# EAGLE design RelAC (EAGLE 9.6.2)
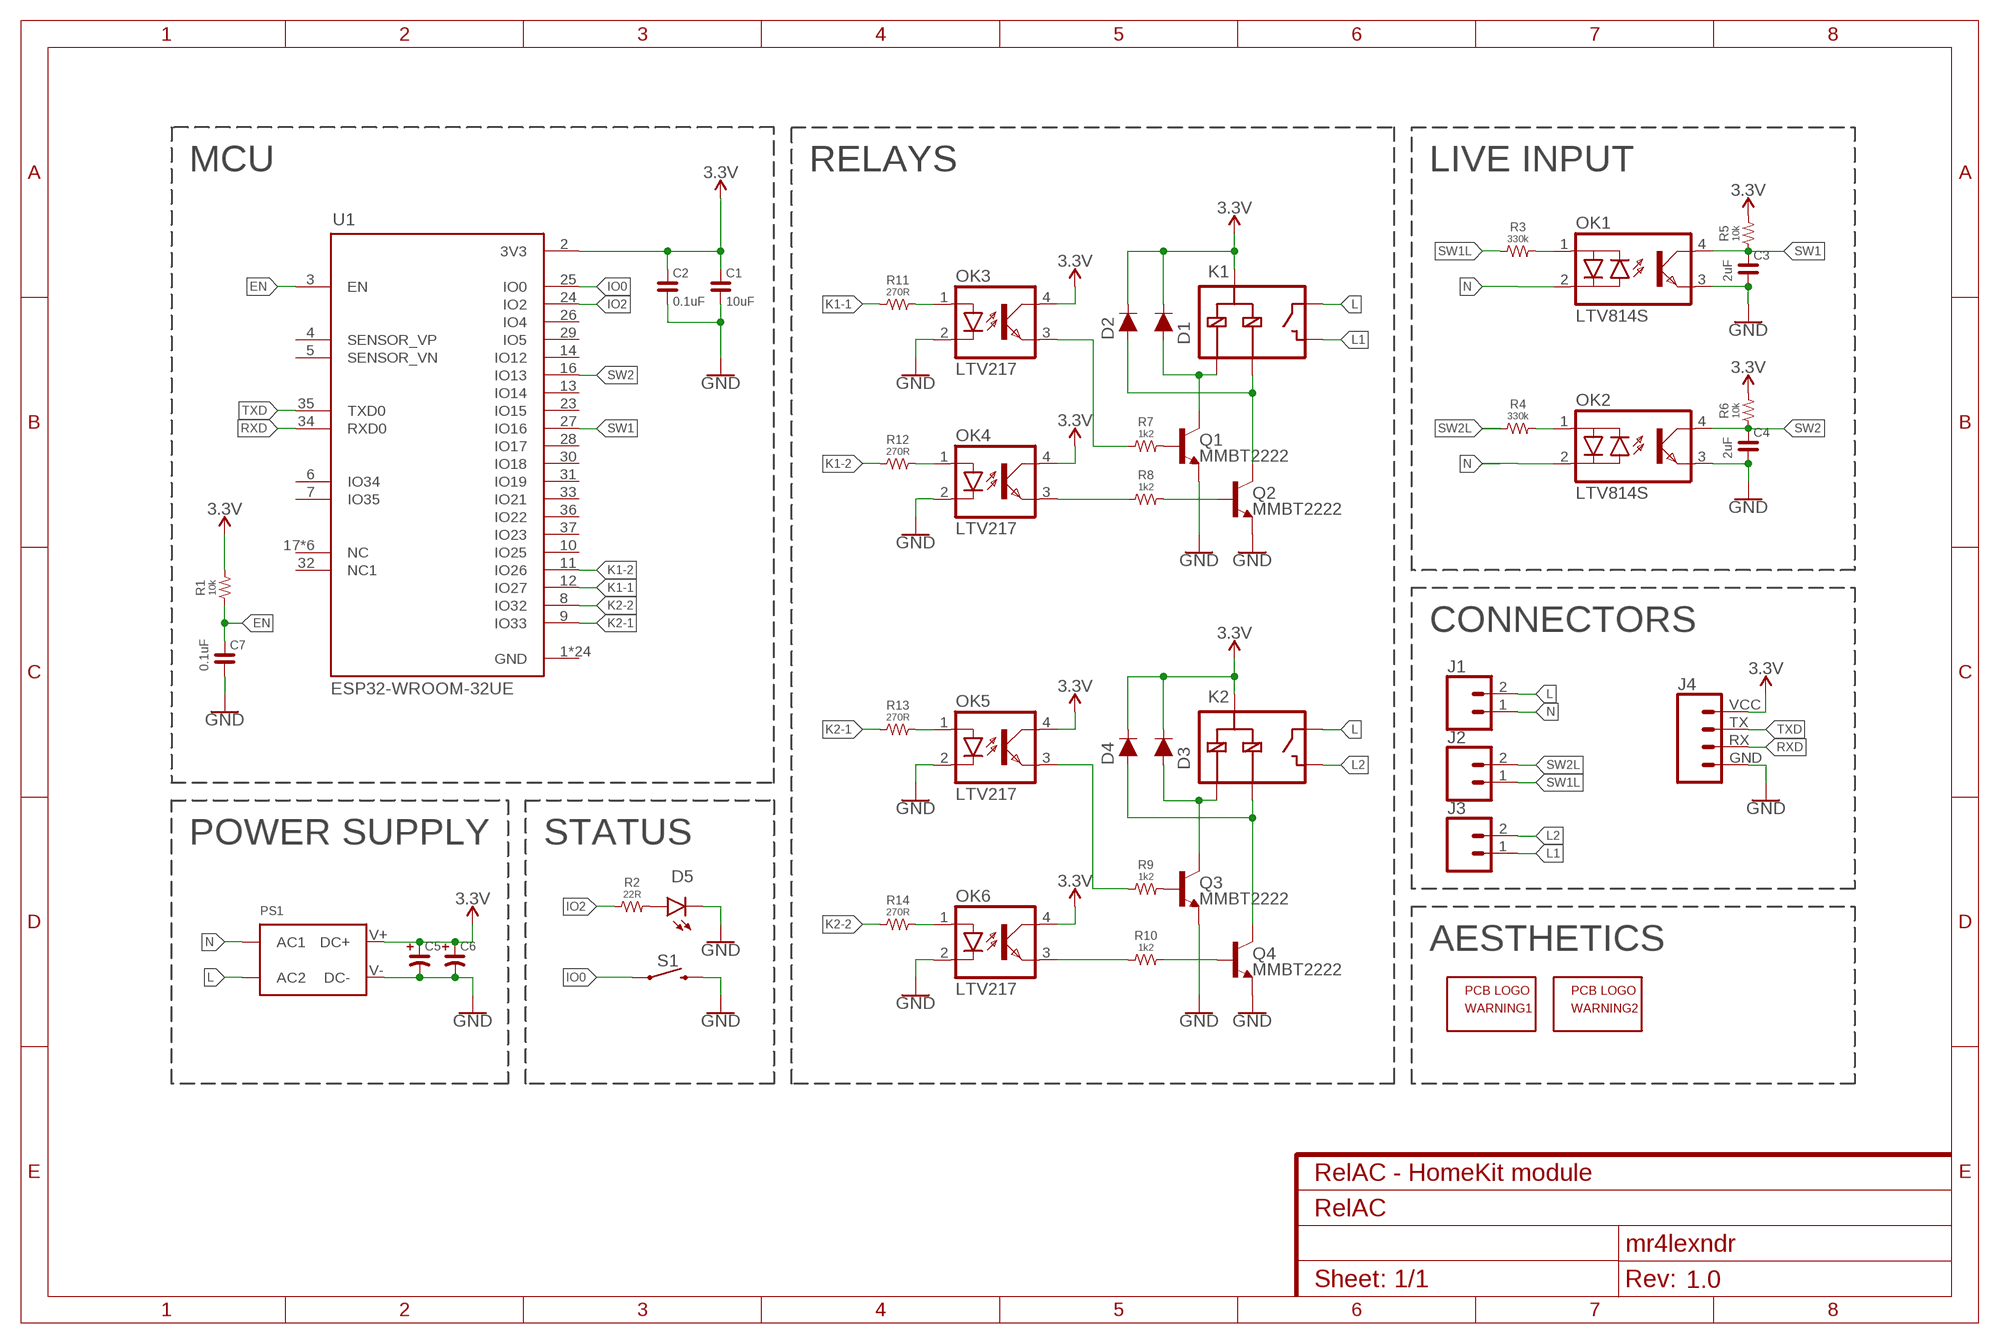
[diagram p0: schematic, sheet 1]
FRAME1 (FRAME-A4L): CNAME: RelAC - HomeKit module; CREVISION: 1.0; DESIGNER: mr4lexndr

## Parts
C1  10uF  CAP-0805  [0805]
C2  0.1uF  CAP-0603  [0603]
C3  2uF  CAP-0805  [0805]
C4  2uF  CAP-0805  [0805]
C5  CAP-POLAR-THT_2.5MM-W  [CPOL-RADIAL-2.5MM-6.5MM]
C6  CAP-POLAR-THT_2.5MM-W  [CPOL-RADIAL-2.5MM-6.5MM]
C7  0.1uF  CAP-0603  [0603]
D1  DIODE-SOD323  [SOD-323]
D2  DIODE-SOD323  [SOD-323]
D3  DIODE-SOD323  [SOD-323]
D4  DIODE-SOD323  [SOD-323]
D5  LED-ANGLE-2MM  [LED-ANGLE-2MM]
J1  CONN_02-5MM-SCREWTERMINAL  [SCREWTERMINAL-5MM-2-DIBO]
J2  CONN_02-5MM-SCREWTERMINAL  [SCREWTERMINAL-5MM-2-DIBO]
J3  CONN_02-5MM-SCREWTERMINAL  [SCREWTERMINAL-5MM-2-DIBO]
J4  CONN_04-UART-SMD  [UART]
K1  RELAY-SPST-LATCHING  [RELAY-PANASONIC-ADW1203HLW]
K2  RELAY-SPST-LATCHING  [RELAY-PANASONIC-ADW1203HLW]
OK1  LTV814S  OPTOCOUPLER-AC-LTV814S  [DIL4-SMD-SMALL]
OK2  LTV814S  OPTOCOUPLER-AC-LTV814S  [DIL4-SMD-SMALL]
OK3  LTV217  OPTOCOUPLER-LTV217  [MINI-FLAT-4]
OK4  LTV217  OPTOCOUPLER-LTV217  [MINI-FLAT-4]
OK5  LTV217  OPTOCOUPLER-LTV217  [MINI-FLAT-4]
OK6  LTV217  OPTOCOUPLER-LTV217  [MINI-FLAT-4]
PS1  POWER-SUPPLY-HI-LINK-5W  [HI-LINK-POWER-SUPPLY]
Q1  MMBT2222  TRANS_NPN-MMBT2222AL  [SOT23-3]
Q2  MMBT2222  TRANS_NPN-MMBT2222AL  [SOT23-3]
Q3  MMBT2222  TRANS_NPN-MMBT2222AL  [SOT23-3]
Q4  MMBT2222  TRANS_NPN-MMBT2222AL  [SOT23-3]
R1  10k  RESISTOR0603  [0603]
R2  22R  RESISTOR0603  [0603]
R3  330k  RESISTOR0805  [0805]
R4  330k  RESISTOR0805  [0805]
R5  10k  RESISTOR0603  [0603]
R6  10k  RESISTOR0603  [0603]
R7  1k2  RESISTOR0603  [0603]
R8  1k2  RESISTOR0603  [0603]
R9  1k2  RESISTOR0603  [0603]
R10  1k2  RESISTOR0603  [0603]
R11  270R  RESISTOR0603  [0603]
R12  270R  RESISTOR0603  [0603]
R13  270R  RESISTOR0603  [0603]
R14  270R  RESISTOR0603  [0603]
S1  MOMENTARY-SWITCH-SPST-PTH-RIGHT-ANGLE-KIT  [TACTILE_SWITCH_PTH_RIGHT_ANGLE_KIT]
U1  ESP32-WROOM-32UE  ESP32-WROOM-32UE(M113EH6400UH3Q0)  [MODULE_ESP32-WROOM-32UE(M113EH6400UH3Q0)]
WARNING1  PCB-GRAPHICS-HIGH-VOLTAGE  [HIGH-VOLTAGE]
WARNING2  PCB-GRAPHICS-HIGH-VOLTAGE  [HIGH-VOLTAGE]

## Nets
3.3V: C1.2 C2.2 C5.+ C6.+ D1.C D2.C D3.C D4.C J4.VCC K1.COILM(COIL-COM) K2.COILM(COIL-COM) OK3.4(COL) OK4.4(COL) OK5.4(COL) OK6.4(COL) PS1.V+(DC+) R1.2 R5.2 R6.2 U1.2(3V3)
EN: C7.2 R1.1 U1.3(EN)
GND: C1.1 C2.1 C3.1 C4.1 C5.- C6.- C7.1 D5.C J4.GND OK1.3(EMIT) OK2.3(EMIT) OK3.2(C) OK4.2(C) OK5.2(C) OK6.2(C) PS1.V-(DC-) Q1.2(E) Q2.2(E) Q3.2(E) Q4.2(E) S1.2
IO0: S1.1 U1.25(IO0)
IO2: R2.1 U1.24(IO2)
K1-1: R11.1 U1.12(IO27)
K1-2: R12.1 U1.11(IO26)
K2-1: R13.1 U1.9(IO33)
K2-2: R14.1 U1.8(IO32)
L: J1.2 K1.POLE K2.POLE PS1.AC2
L1: J3.1 K1.NO
L2: J3.2 K2.NO
N: J1.1 OK1.2(C) OK2.2(C) PS1.AC1
N$2: D2.A K1.COIL2 Q2.3(C)
N$3: D1.A K1.COIL1 Q1.3(C)
N$4: OK1.1(A) R3.2
N$6: D5.A R2.2
N$7: OK2.1(A) R4.2
N$9: Q1.1(B) R7.2
N$10: Q2.1(B) R8.2
N$11: OK3.3(EMIT) R7.1
N$12: OK4.3(EMIT) R8.1
N$13: D3.A K2.COIL1 Q3.3(C)
N$14: D4.A K2.COIL2 Q4.3(C)
N$15: Q3.1(B) R9.2
N$16: Q4.1(B) R10.2
N$17: OK6.3(EMIT) R10.1
N$18: OK5.3(EMIT) R9.1
N$25: OK6.1(A) R14.2
N$26: OK5.1(A) R13.2
N$27: OK4.1(A) R12.2
N$28: OK3.1(A) R11.2
RXD: J4.RX U1.34(RXD0)
SW1: C3.2 OK1.4(COL) R5.1 U1.27(IO16)
SW1L: J2.1 R3.1
SW2: C4.2 OK2.4(COL) R6.1 U1.16(IO13)
SW2L: J2.2 R4.1
TXD: J4.TX U1.35(TXD0)
Unconnected: U1.4(SENSOR_VP) U1.5(SENSOR_VN) U1.6(IO34) U1.7(IO35) U1.10(IO25) U1.13(IO14) U1.14(IO12) U1.17(NC) U1.18(NC) U1.19(NC) U1.20(NC) U1.21(NC) U1.22(NC) U1.23(IO15) U1.26(IO4) U1.28(IO17) U1.29(IO5) U1.30(IO18) U1.31(IO19) U1.32(NC1) U1.33(IO21) U1.36(IO22) U1.37(IO23)

## Notes on the sheet
- MCU | RELAYS | LIVE INPUT
- CONNECTORS
- POWER SUPPLY | STATUS
- AESTHETICS

## Power pins joined to a net without a drawn wire
GND: U1.1(GND) U1.15(GND) U1.38(GND) U1.39_1(GND) U1.39_2(GND) U1.39_3(GND) U1.39_4(GND) U1.39_5(GND) U1.39_6(GND) U1.39_7(GND) U1.39_8(GND) U1.39_9(GND) U1.39_10(GND) U1.39_11(GND) U1.39_12(GND) U1.39_13(GND) U1.39_14(GND) U1.39_15(GND) U1.39_16(GND) U1.39_17(GND) U1.39_18(GND) U1.39_19(GND) U1.39_20(GND) U1.39_21(GND)

## Library data of the parts
C1-C4 C7 = #AK-Library:CAP
C5 C6 = #AK-Library:CAP-POLAR: POLARIZED CAP
D1-D4 = #AK-Library:DIODE
D5 = #AK-Library:LED: LED (Generic) Standard schematic elements and footprints for 5mm, 3mm, 1206, and 0603 sized LEDs. Generic LEDs with no color specified.
J1-J3 = #Connectors:CONN_02: Multi connection point. Often used as Generic Header-pin footprint for 0.1 inch spaced/style header connections On any of the 0.1 inch spaced packages, you can populate with these: Break Away Headers - Straight <https://www.sparkfun.com/products/116> (PRT-00116) Break Away Male Headers - Right Angle <https://www.sparkfun.com/products/553> (PRT-00553) Female Headers <https://www.sparkfun.com/products/115> (PRT-00115) Break Away Headers - Machine Pin <https://www.sparkfun.com/products/117> (PRT-00117) Break Away Female Headers - Swiss Machine Pin <https://www.sparkfun.com/products/743> (PRT-00743) For SCREWTERMINALS and SPRING TERMINALS visit here: Screw Terimnals on SparkFun.com <https://www.sparkfun.com/search/results?term=Screw+Terminals> (5mm/3.5mm/2.54mm spacing) This device is also useful as a general connection point to wire up your design to another part of your project. Our various solder wires solder well into these plated through hole pads. Hook-Up Wire - Assortment (Stranded, 22 AWG) <https://www.sparkfun.com/products/11375> (PRT-11375) Hook-Up Wire - Assortment (Solid Core, 22 AWG) <https://www.sparkfun.com/products/11367> (PRT-11367) View the entire wire category on our website here <https://www.sparkfun.com/categories/141> Special notes: Molex polarized connector foot print use with: PRT-08233 with associated crimp pins and housings. 2.54_SCREWTERM for use with PRT-10571. 3.5mm Screw Terminal footprints for PRT-08084 5mm Screw Terminal footprints for use with PRT-08432
J4 = #Connectors:CONN_04: Multi connection point. Often used as Generic Header-pin footprint for 0.1 inch spaced/style header connections On any of the 0.1 inch spaced packages, you can populate with these: Break Away Headers - Straight <https://www.sparkfun.com/products/116> (PRT-00116) Break Away Male Headers - Right Angle <https://www.sparkfun.com/products/553> (PRT-00553) Female Headers <https://www.sparkfun.com/products/115> (PRT-00115) Break Away Headers - Machine Pin <https://www.sparkfun.com/products/117> (PRT-00117) Break Away Female Headers - Swiss Machine Pin <https://www.sparkfun.com/products/743> (PRT-00743) For SCREWTERMINALS and SPRING TERMINALS visit here: Screw Terimnals on SparkFun.com <https://www.sparkfun.com/search/results?term=Screw+Terminals> (5mm/3.5mm/2.54mm spacing) This device is also useful as a general connection point to wire up your design to another part of your project. Our various solder wires solder well into these plated through hole pads. Hook-Up Wire - Assortment (Stranded, 22 AWG) <https://www.sparkfun.com/products/11375> (PRT-11375) Hook-Up Wire - Assortment (Solid Core, 22 AWG) <https://www.sparkfun.com/products/11367> (PRT-11367) View the entire wire category on our website here <https://www.sparkfun.com/categories/141> Special notes: Molex polarized connector foot print use with SKU : PRT-08231 with associated crimp pins and housings. 1MM SMD Version SKU: PRT-10208
K1 K2 = #AK-Library:RELAY-SPST-LATCHING
OK1 OK2 = #AK-Library:OPTOCOUPLER-AC
OK3-OK6 = #AK-Library:OPTOCOUPLER: OPTO COUPLER Source: LITEON, LTV816.pdf
PS1 = #AK-Library:POWER-SUPPLY
Q1-Q4 = #AK-Library:TRANS_NPN: NPN transistor Current controlled devices typically used to amplify current or used as a switch. BC547 - COM-08928 <http://www.sparkfun.com/products/8928> (TO-92 45V 100mA) (1.Collector 2.Base 3.Emitter) 2N3904 - COM-00521 <http://www.sparkfun.com/products/521> (TO-92 40V 200mA) (1.Emitter 2.Base 3.Collector) P2N2222A - COM-12852 <http://www.sparkfun.com/products/12852> (TO-92 40V 600mA) (1.Collector 2.Base 3.Emitter); PROD_ID: TRANS-08049; VALUE: 600mA/40V
R1-R14 = #AK-Library:RESISTOR: Generic Resistor Package
S1 = #AK-Library:MOMENTARY-SWITCH-SPST: Momentary Switch (Pushbutton) - SPST Normally-open (NO) SPST momentary switches (buttons, pushbuttons). Variants PTH-12MM - 12mm square, through-hole Momentary Pushbutton Switch - 12mm Square <https://www.sparkfun.com/products/9190> (COM-09190) PTH-6.0MM, PTH-6.0MM-KIT - 6.0mm square, through-hole Mini Pushbutton Switch <https://www.sparkfun.com/products/97> (COM-00097) KIT package intended for soldering kit's - only one side of pads' copper is exposed. PTH-RIGHT-ANGLE-KIT - Right-angle, through-hole Right Angle Tactile Button <https://www.sparkfun.com/products/10791> - Used on SparkFun BigTime Watch Kit <https://www.sparkfun.com/products/11734> SMD-12MM - 12mm square, surface-mount Tactile Button - SMD (12mm) <https://www.sparkfun.com/products/12993> (COM-12993) Used on SparkFun PicoBoard <https://www.sparkfun.com/products/11888> SMD-4.5MM - 4.5mm Square Trackball Switch Used on SparkFun Blackberry Trackballer Breakout <https://www.sparkfun.com/products/13169> SMD-4.6MMX2.8MM - 4.60mm x 2.80mm, surface mount Used on SparkFun SAMD21 Mini Breakout <https://www.sparkfun.com/products/13664> SMD-5.2MM, SMD-5.2-REDUNDANT - 5.2mm square, surface-mount Mini Pushbutton Switch - SMD <https://www.sparkfun.com/products/8720> (COM-08720) Used on Arduino Pro Mini <https://www.sparkfun.com/products/11114> REDUNDANT package connects both switch circuits together SMD-6.0X3.5MM - 6.0 x 3.5mm, surface mount Momentary Reset Switch SMD <https://www.sparkfun.com/products/8229> (COM-08229) SMD-6.2MM-TALL - 6.2mm square, surface mount Tactile Button - SMD (6mm) <https://www.sparkfun.com/products/12992> Used on SparkFun Digital Sandbox <https://www.sparkfun.com/products/12651> SMD-RIGHT-ANGLE - Right-angle, surface mount Used on SparkFun Block for Intel® Edison - Arduino <https://www.sparkfun.com/products/13036>; PROD_ID: CONN-10672; SF_SKU: COM-10791
U1 = #AK-Library:ESP32-WROOM-32UE(M113EH6400UH3Q0): WiFi Modules (802.11) SMD module ESP32-D0WD-V3, ESP32 ECO V3, 8 MB SPI flash, IPEX antenna connector Check availability <https://pricing.snapeda.com/parts/ESP32-WROOM-32UE%28M113EH6400UH3Q0%29/Espressif%20Systems/view-part?ref=eda>; AVAILABILITY: Not in stock; DESCRIPTION: Bluetooth, WiFi 802.11b/g/n, Bluetooth v4.2 +EDR, Class 1, 2 and 3 Transceiver Module 2.4GHz ~ 2.5GHz Antenna Not Included, U.FL Surface Mount; MF: Espressif Systems; MP: ESP32-WROOM-32UE(M113EH6400UH3Q0); PACKAGE: None; PRICE: None
WARNING1 WARNING2 = #AK-Library:PCB-GRAPHICS

## Board
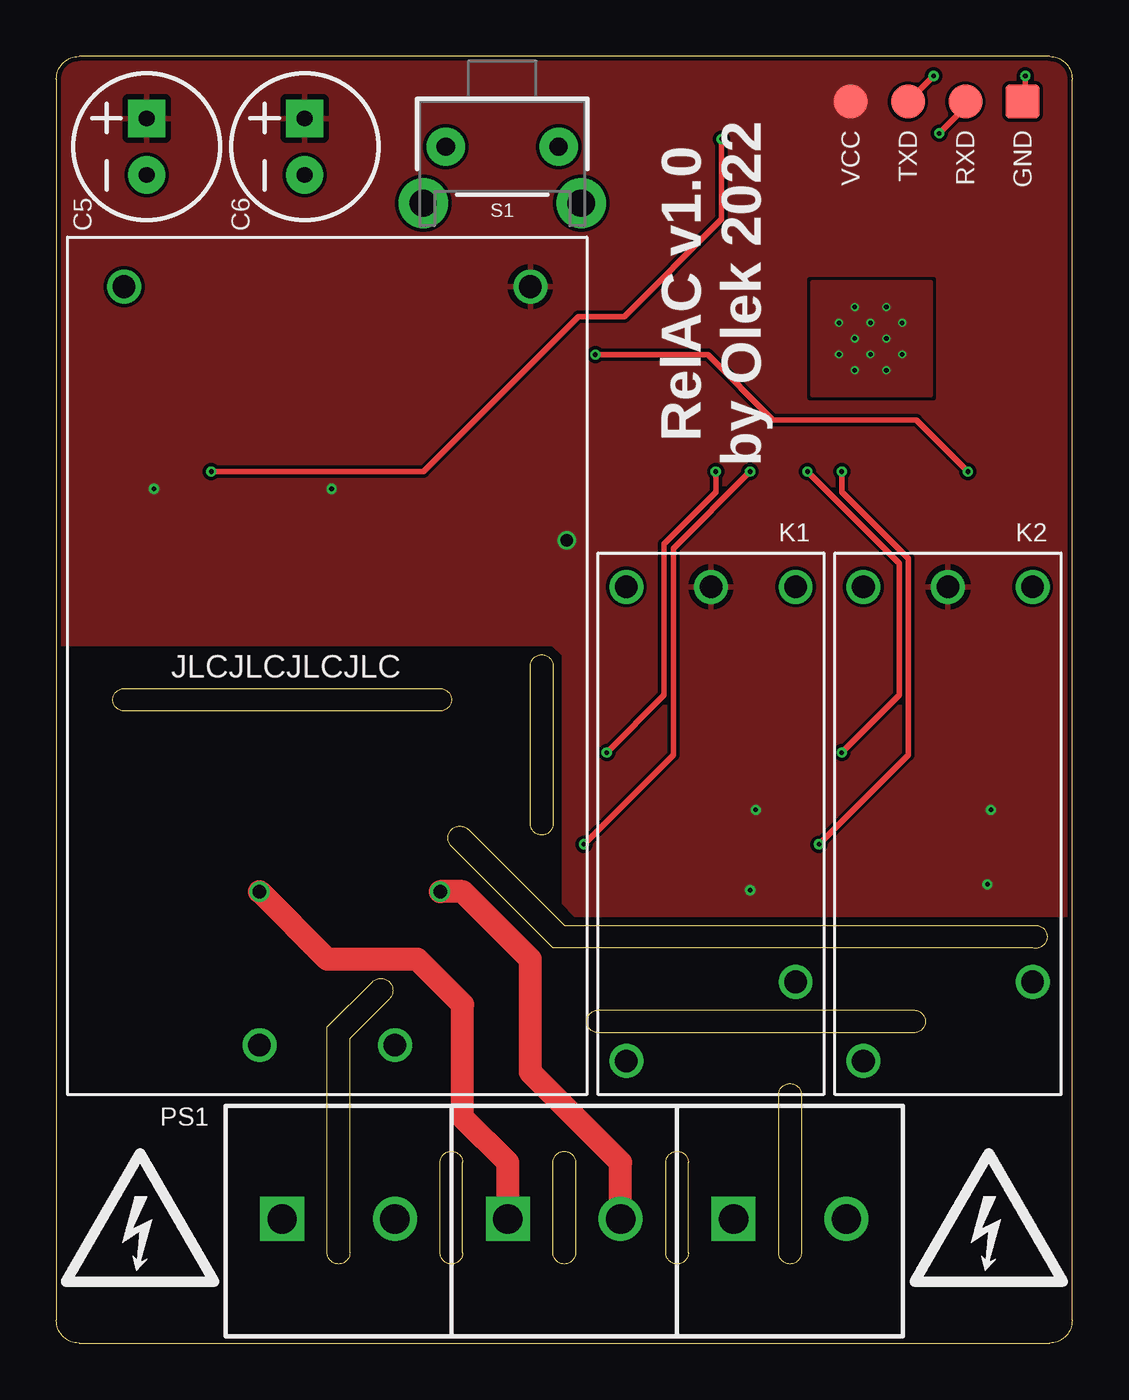
[diagram p1: board, top side]
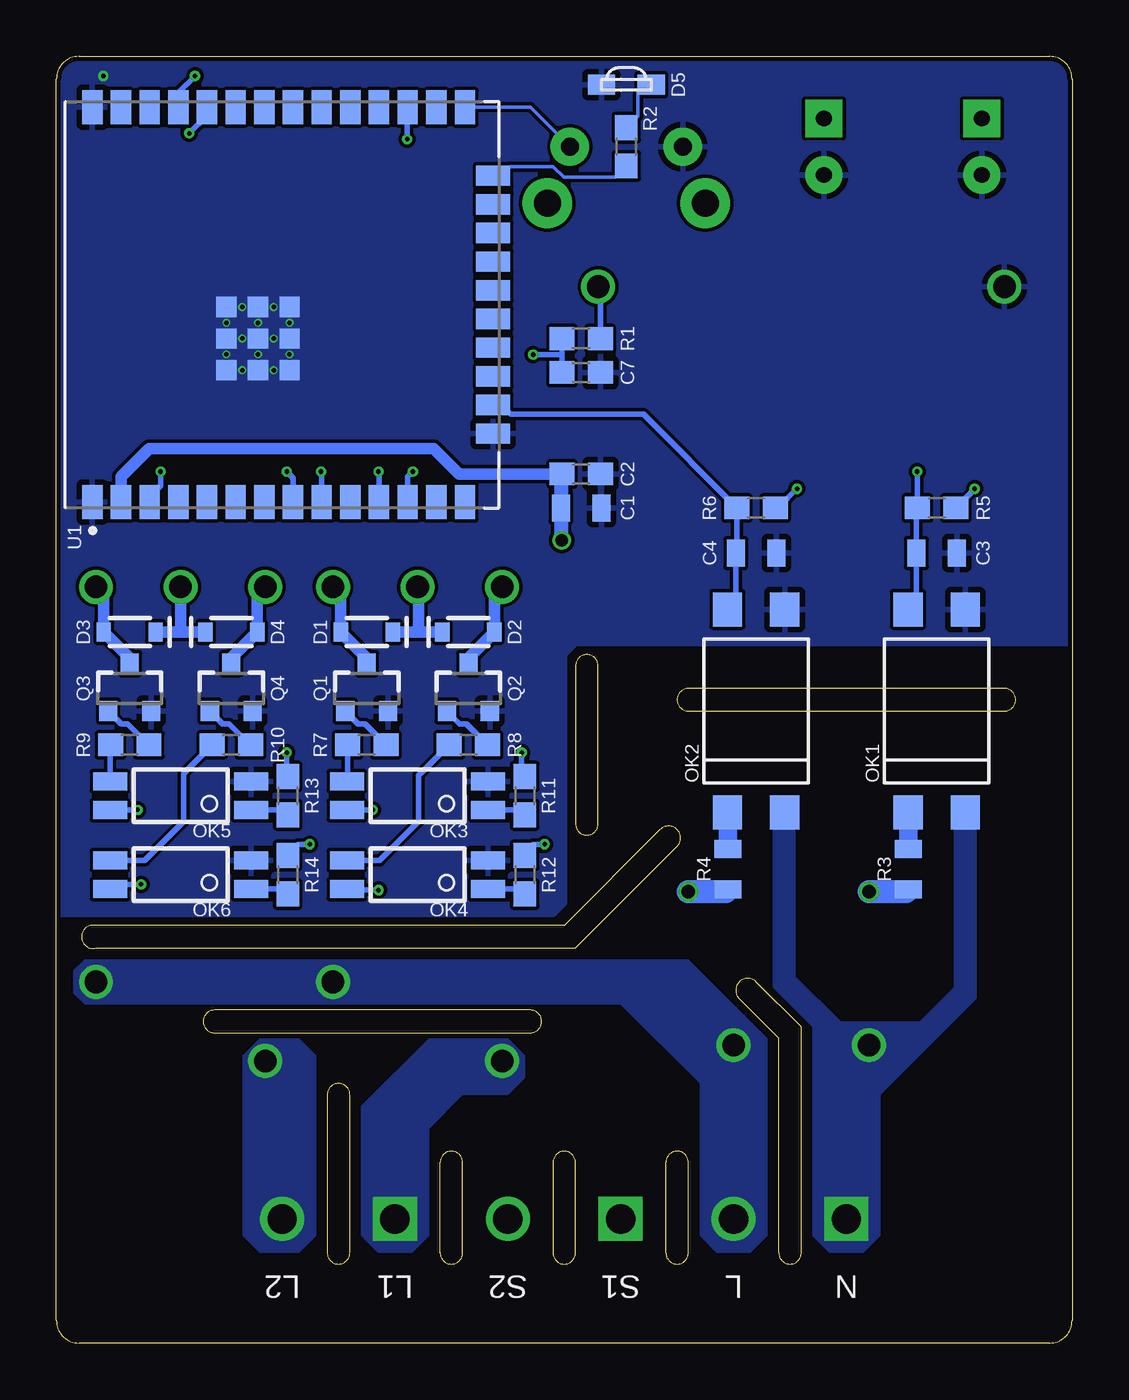
[diagram p2: board, bottom side, seen from below]

Size 45 x 57 mm. Coordinates in mm from the lower left corner, seen from the top.
Outline: 1,0 44,0 arc90 45,1 45,56 arc90 44,57 1,57 arc90 0,56 0,1 arc90 1,0
Outline: 43.25,17.5 22,17.5 17.5,22 arc-180 18.25,22.75 22.5,18.5 43.5,18.5 arc-180 43.25,17.5
Outline: 3,29 17,29 arc-180 17,28 3,28 arc-180 3,29
Outline: 22,30 22,23 arc-180 21,23 21,30 arc-180 22,30
Outline: 13,4 13,13.5 14.75,15.25 arc180 14,16 12,14 12,4 arc180 13,4
Outline: 18,4 18,8 arc180 17,8 17,4 arc180 18,4
Outline: 22,4 22,8 arc-180 23,8 23,4 arc-180 22,4
Outline: 27,4 27,8 arc-180 28,8 28,4 arc-180 27,4
Outline: 32,4 32,11 arc-180 33,11 33,4 arc-180 32,4
Outline: 38,13.75 24,13.75 arc-180 24,14.75 38,14.75 arc-180 38,13.75
Copper layers (1*16): Top 0.035mm / dielectric 1.5mm / Bottom 0.035mm
Design rules "JLCPCB": minimum track width 6mil, minimum drill 0.2mm, track to track 6mil, track to pad 6mil, pad to pad 6mil, via to via 6mil, smd to smd 6mil, copper to edge 0.2mm, drill to drill 0.1mm, minimum pad ring 3mil, minimum via ring 0.125mm, stop-mask expansion 4mil, vias tented up to drill 0.75mm, thermal gap 10mil

### Footprints (pad centres in the part's own frame; a part is rotated, then mirrored left to right if it is on the bottom)
0805 = smd 0.8 x 1.2: 1 -0.9,0; 2 0.9,0
0603 = smd 1.1 x 1: 1 -0.85,0; 2 0.85,0
CPOL-RADIAL-2.5MM-6.5MM = drill 0.7 pad 1.651 square: + 1.25,0 | drill 0.7 pad 1.651: - -1.25,0
SOD-323 = smd 0.63 x 0.83: A 1.15,0; C -1.15,0
LED-ANGLE-2MM = smd 0.9 x 1.2: A 0,1.1; C 0,-1.1
SCREWTERMINAL-5MM-2-DIBO = drill 1.3 square: 1 0,0 | drill 1.3: 2 5,0
UART = smd 1.5 x 1.5: GND -3.81,0; RX -1.27,0; TX 1.27,0; VCC 3.81,0
RELAY-PANASONIC-ADW1203HLW = drill 1: COIL1 -10.5,3.75; COIL2 -10.5,-3.75; COILM -10.5,0; NO 10.5,-3.75; POLE 7,3.75
DIL4-SMD-SMALL = smd 1.3 x 1.5: 1 -1.27,-4.5; 2 1.27,-4.5; 3 1.27,4.5; 4 -1.27,4.5
MINI-FLAT-4 = smd 1.5 x 0.8: 1 -3.125,0.635; 2 -3.125,-0.635; 3 3.125,-0.635; 4 3.125,0.635
HI-LINK-POWER-SUPPLY = drill 1: AC1 -16.8,3; AC2 -16.8,-3; V+ 16.8,-9; V- 16.8,9
SOT23-3 = smd 0.8 x 0.9: 1 -0.95,-1; 2 0.95,-1; 3 0,1.1
TACTILE_SWITCH_PTH_RIGHT_ANGLE_KIT = drill 0.8 pad 1.7: 1 -2.5,0; 2 2.5,0 | drill 1.2 pad 2.2: ANCHOR1 -3.5,2.5; ANCHOR2 3.5,2.5
MODULE_ESP32-WROOM-32UE(M113EH6400UH3Q0) = smd 1.5 x 0.9: 1 -8.75,8.41; 2 -8.75,7.14; 3 -8.75,5.87; 4 -8.75,4.6; 5 -8.75,3.33; 6 -8.75,2.06; 7 -8.75,0.79; 8 -8.75,-0.48; 9 -8.75,-1.75; 10 -8.75,-3.02; 11 -8.75,-4.29; 12 -8.75,-5.56; 13 -8.75,-6.83; 14 -8.75,-8.1; 25 8.75,-8.1; 26 8.75,-6.83; 27 8.75,-5.56; 28 8.75,-4.29; 29 8.75,-3.02; 30 8.75,-1.75; 31 8.75,-0.48; 32 8.75,0.79; 33 8.75,2.06; 34 8.75,3.33; 35 8.75,4.6; 36 8.75,5.87; 37 8.75,7.14; 38 8.75,8.41 | smd 0.9 x 1.5: 15 -5.71,-9.35; 16 -4.44,-9.35; 17 -3.17,-9.35; 18 -1.9,-9.35; 19 -0.63,-9.35; 20 0.64,-9.35; 21 1.91,-9.35; 22 3.18,-9.35; 23 4.45,-9.35; 24 5.72,-9.35 | smd 0.9 x 0.9: 39_1 -2.9,2.47; 39_2 -1.5,2.47; 39_3 -0.1,2.47; 39_4 -2.9,1.07; 39_5 -1.5,1.07; 39_6 -0.1,1.07; 39_7 -2.9,-0.33; 39_8 -1.5,-0.33; 39_9 -0.1,-0.33 | drill 0.2 pad 0.3: 39_10 -2.2,2.47; 39_11 -0.8,2.47; 39_12 -2.9,1.77; 39_13 -1.5,1.77; 39_14 -0.1,1.77; 39_15 -2.2,1.07; 39_16 -0.8,1.07; 39_17 -2.9,0.37; 39_18 -1.5,0.37; 39_19 -0.1,0.37; 39_20 -2.2,-0.33; 39_21 -0.8,-0.33

### Placement (x,y rotation side)
C1  21.75,37 180 bottom
C2  21.75,38.5 180 bottom
C3  6,35 180 bottom
C4  14,35 180 bottom
C5  4,53 90 top
C6  11,53 90 top
C7  21.75,43 180 bottom
D1  31.25,31.5 180 bottom
D2  26.75,31.5 0 bottom
D3  41.75,31.5 180 bottom
D4  37.25,31.5 0 bottom
D5  19.75,55.75 270 bottom
J1  10,5.5 0 top
J2  20,5.5 0 top
J3  30,5.5 0 top
J4  39,55 180 top
K1  29,23 270 top
K2  39.5,23 270 top
OK1  6,28 0 bottom
OK2  14,28 0 bottom
OK3  29,24.25 180 bottom
OK4  29,20.75 180 bottom
OK5  39.5,24.25 180 bottom
OK6  39.5,20.75 180 bottom
PS1  12,30 90 top
Q1  31.25,29 0 bottom
Q2  26.75,29 0 bottom
Q3  41.75,29 0 bottom
Q4  37.25,29 0 bottom
R1  21.75,44.5 0 bottom
R2  19.75,53 90 bottom
R3  7.25,21 90 bottom
R4  15.25,21 90 bottom
R5  6,37 0 bottom
R6  14,37 0 bottom
R7  31.25,26.5 0 bottom
R8  26.75,26.5 0 bottom
R9  41.75,26.5 0 bottom
R10  37.25,26.5 0 bottom
R11  24.25,24.25 270 bottom
R12  24.25,20.75 270 bottom
R13  34.75,24.25 270 bottom
R14  34.75,20.75 270 bottom
S1  19.75,53 180 top
U1  35,46 90 bottom
WARNING1  3.7,2.5 0 top
WARNING2  41.3,2.5 0 top

### Tracks (layer width: path | path; a pad name or v marks a point on that pad's centre or on a via)
3.3V  (via drill 0.2, 0.55)
  Bottom 0.254: R1.2 20.9,46.56 arc-45 PS1.V+ | OK4.4 32.08,20.07 v30.73,20.07 | OK6.4 42.58,20.32 v41.25,20.32 | OK5.4 v41.41,23.61 v41.4,23.62 | OK3.4 v31,23.61 v30.99,23.62 | v41.25,20.32 | R5.2 4.32,37.83 v4.32,37.85 | R6.2 13.04,37 v12.19,37.85
  Bottom 0.508: D2.C 28.96,31.5 | 28.96,31.5 D1.C | 28.96,31.5 28.96,33.46 K1.COILM | D4.C 39.37,31.5 39.62,31.5 | 39.62,31.5 D3.C | 39.62,31.5 39.5,31.62 K2.COILM | U1.2 42.14,38.38 40.89,39.62 28.29,39.62 27.17,38.5 C2.2 22.65,38.45 | 22.65,35.6 v22.61,35.56
  Bottom 0.61: 22.65,38.45 C1.2 22.65,35.6
  pour Top (rank 3): -1,31 22,31 22.5,30.5 22.5,19.5 23,19 46,19 46,57 45,58 0,58 -1,57
EN  (via drill 0.2)
  Top 0.254: v23.88,43.79 28.85,43.79 31.75,40.89 38.1,40.89 39.62,39.37 v40.39,38.61
  Bottom 0.254: C7.2 R1.1 22.6,43.8 22.61,43.79 v23.88,43.79 | v40.39,38.61 40.39,37.99 40.87,37.5 U1.3
GND  (via drill 0.2)
  Top 0.254: J4.GND 42.93,55.12 v42.93,56.13
  pour Bottom: 46,19 23,19 22.5,19.5 22.5,30.5 22,31 0,31 0,57 1,58 45,58 46,57
  pour Bottom (rank 2, no thermals): 33.5,47 38.5,47 38.5,42 33.5,42
  pour Top (no thermals): 33.5,47 38.75,47 38.75,42 33.5,42
IO0
  Bottom 0.152: U1.25 24,54.75 S1.1
  Bottom 0.254: 26.79,54.86 U1.25
IO2
  Bottom 0.152: 25.29,51.72 24.89,52.12 23,52.12 22.52,51.65 21.34,51.65 | 21.34,51.65 21.25,51.65 | 21.34,51.65 20.25,51.65 R2.1
  Bottom 0.254: 25.29,51.72 U1.24
K1-1  (via drill 0.2)
  Top 0.254: v29.21,38.61 29.21,37.69 26.92,35.41 26.92,28.7 v24.38,26.16
  Bottom 0.254: v24.38,26.16 24.38,25.23 R11.1 | U1.12 29.44,38.38 v29.21,38.61
K1-2  (via drill 0.2)
  Top 0.254: v30.73,38.61 27.33,35.2 27.33,26.06 v23.37,22.1
  Bottom 0.254: v23.37,22.1 23.88,22.1 24.25,21.72 R12.1 | U1.11 30.71,38.58 v30.73,38.61
K2-1  (via drill 0.2)
  Top 0.254: v33.27,38.61 37.34,34.54 37.34,28.7 v34.8,26.16
  Bottom 0.254: U1.9 33.25,38.55 arc-45 v33.27,38.61 | v34.8,26.16 34.8,25.15 R13.1
K2-2  (via drill 0.2)
  Top 0.254: v34.8,38.61 34.8,37.69 37.74,34.75 37.74,26.06 v33.78,22.1
  Bottom 0.254: U1.8 34.52,38.33 v34.8,38.61 | v33.78,22.1 34.29,22.1 34.75,21.64 R14.1
L
  pour Bottom (no thermals): 44.25,16.5 44.25,15.5 43.75,15 20,15 16.5,11.5 16.5,4.75 15.75,4 14.25,4 13.5,4.75 13.5,13.5 17,17 43.75,17
L1
  pour Bottom (no thermals): 31.5,4.75 31.5,10.5 28.5,13.5 25,13.5 24.25,12.75 24.25,11.75 25,11 27,11 28.5,9.5 28.5,4.75 29.25,4 30.75,4
L2
  pour Bottom (no thermals): 36.75,4.75 36.75,12.75 36,13.5 34.25,13.5 33.5,12.75 33.5,4.75 34.25,4 36,4
N
  pour Bottom (no thermals): 11.5,4.75 10.75,4 9.25,4 8.5,4.75 8.5,11 4.25,15.25 4.25,24 5.25,24 5.25,15.75 6.75,14.25 10.25,14.25 12.25,16.25 12.25,24 13.25,24 13.25,15.75 11.5,14
N$2
  Bottom 0.508: K1.COIL2 25.6,33.15 D2.A 26.75,30.35 Q2.3
N$3
  Bottom 0.508: K1.COIL1 32.4,33.15 D1.A 31.25,30.35 Q1.3
N$4
  Bottom 0.813: R3.2 7.25,23.48 OK1.1
N$6
  Bottom 0.152: R2.2 19.24,54.36 19.24,55.41 18.9,55.75 D5.A
N$7
  Bottom 0.813: R4.2 15.25,23.48 OK2.1
N$9
  Bottom 0.254: Q1.1 31.63,27.43 31.33,27.43 R7.2
N$10
  Bottom 0.254: Q2.1 27.13,27.43 26.83,27.43 R8.2
N$11
  Bottom 0.254: R7.1 32.1,24.91 OK3.3
N$12
  Bottom 0.254: R8.1 28.96,25.14 28.96,23.11 30.68,21.39 OK4.3
N$13
  Bottom 0.508: K2.COIL1 42.9,33.15 D3.A 41.75,30.35 Q3.3
N$14
  Bottom 0.508: K2.COIL2 36.1,33.15 D4.A 37.25,30.35 Q4.3
N$15
  Bottom 0.254: Q3.1 42.13,27.43 41.83,27.43 R9.2
N$16
  Bottom 0.254: Q4.1 37.63,27.43 37.34,27.43 R10.2
N$17
  Bottom 0.254: R10.1 39.37,25.23 39.37,23.11 41.1,21.39 OK6.3
N$18
  Bottom 0.254: R9.1 42.62,26.48 OK5.3
N$25
  Bottom 0.254: OK6.1 34.97,20.11 R14.2
N$26
  Bottom 0.254: OK5.1 34.97,23.61 R13.2
N$27
  Bottom 0.254: OK4.1 24.46,20.11 R12.2
N$28
  Bottom 0.254: OK3.1 24.46,23.61 R11.2
RXD  (via drill 0.2)
  Top 0.254: J4.RX 40.27,54.75 v39.12,53.59
  Bottom 0.254: v39.12,53.59 38.33,54.38 U1.34
SW1  (via drill 0.2)
  Top 0.254: v29.46,53.34 29.46,49.78 25.16,45.48 23.13,45.48 16.26,38.61 v6.86,38.61
  Bottom 0.254: U1.27 29.46,54.73 v29.46,53.34 | v6.86,38.61 R5.1 6.9,36.95 C3.2 6.9,32.87 OK1.4
SW1L  (via drill 0.6)
  Top 1.016: J2.1 20,8 18,10 18,15 16,17 12,17 v9,20
  Bottom 0.813: 7.35,20 R3.1
  Bottom 1.016: v9,20 7.35,20
SW2
  Bottom 0.254: U1.16 25.3,41.56 24.89,41.15 19,41.15 R6.1 14.85,35.05 C4.2 14.9,32.87 OK2.4
SW2L  (via drill 0.6)
  Top 1.016: J2.2 25,8 21,12 21,17 18,20 v17,20
  Bottom 0.813: R4.1 15.35,20
  Bottom 1.016: v17,20 15.35,20
TXD  (via drill 0.2)
  Top 0.254: J4.TX v38.86,56.13
  Bottom 0.254: v38.86,56.13 39.6,55.4 U1.35

### Text on the board
tNames: RelAC v1.0 / by Olek 2022 | JLCJLCJLCJLC
bNames: N | L | S1 | S2 | L1 | L2